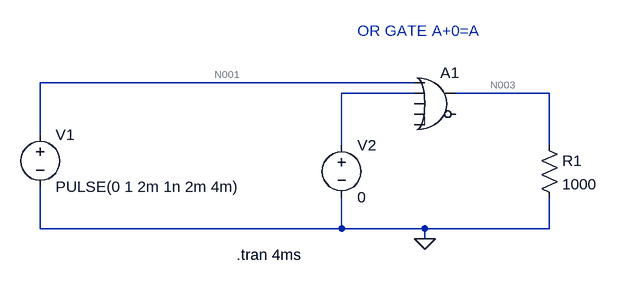
[diagram p0: schematic Draft1.asc]
Draft1.asc, the LTspice schematic file:
Version 4
SHEET 1 880 680
WIRE 128 96 -448 96
WIRE 128 112 16 112
WIRE 336 112 192 112
WIRE -448 176 -448 96
WIRE 16 192 16 112
WIRE 336 192 336 112
WIRE -448 320 -448 256
WIRE 16 320 16 272
WIRE 16 320 -448 320
WIRE 144 320 16 320
WIRE 336 320 336 272
WIRE 336 320 144 320
WIRE 144 336 144 320
FLAG 144 336 0
SYMBOL Digital\\or 160 64 R0
SYMATTR InstName A1
SYMBOL voltage 16 176 R0
SYMATTR InstName V2
SYMATTR Value 0
SYMBOL voltage -448 160 R0
WINDOW 123 0 0 Left 0
WINDOW 39 0 0 Left 0
SYMATTR InstName V1
SYMATTR Value PULSE(0 1 2m 1n 2m 4m)
SYMBOL res 320 176 R0
SYMATTR InstName R1
SYMATTR Value 1000
TEXT 40 16 Left 2 ;OR GATE A+0=A
TEXT -146 360 Left 2 !.tran 4ms

The netlist it stands for:
* Draft1.asc
A1 N001 N002 0 0 0 0 N003 0 OR
V2 N002 0 0
V1 N001 0 PULSE(0 1 2m 1n 2m 4m)
R1 N003 0 1000
* OR GATE A+0=A
.tran 4ms
.backanno
.end

* Results of the author's LTspice run, read from the files saved beside the schematic
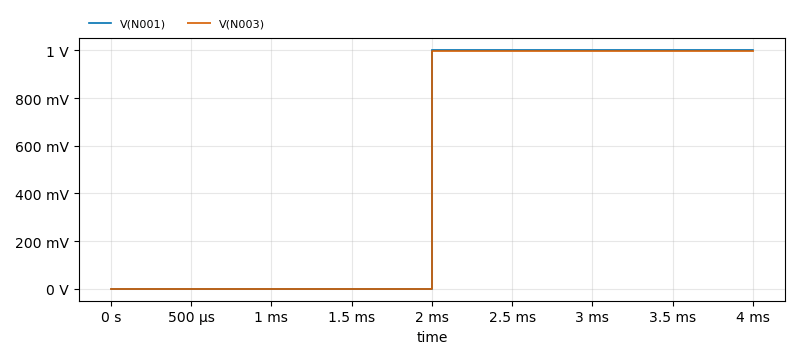
[diagram p1: Transient Analysis of Draft1.asc, plotted from the saved traces]
* Transient Analysis, 1 run:
*   V(N001): min 0 V, max 1 V, average 500 mV, rms 707.1 mV, last 1 V
*   V(N003): min 0 V, max 999 mV, average 499.5 mV, rms 706.4 mV, last 999 mV